# EAGLE schematic WatchDawg (EAGLE 9.4.2)
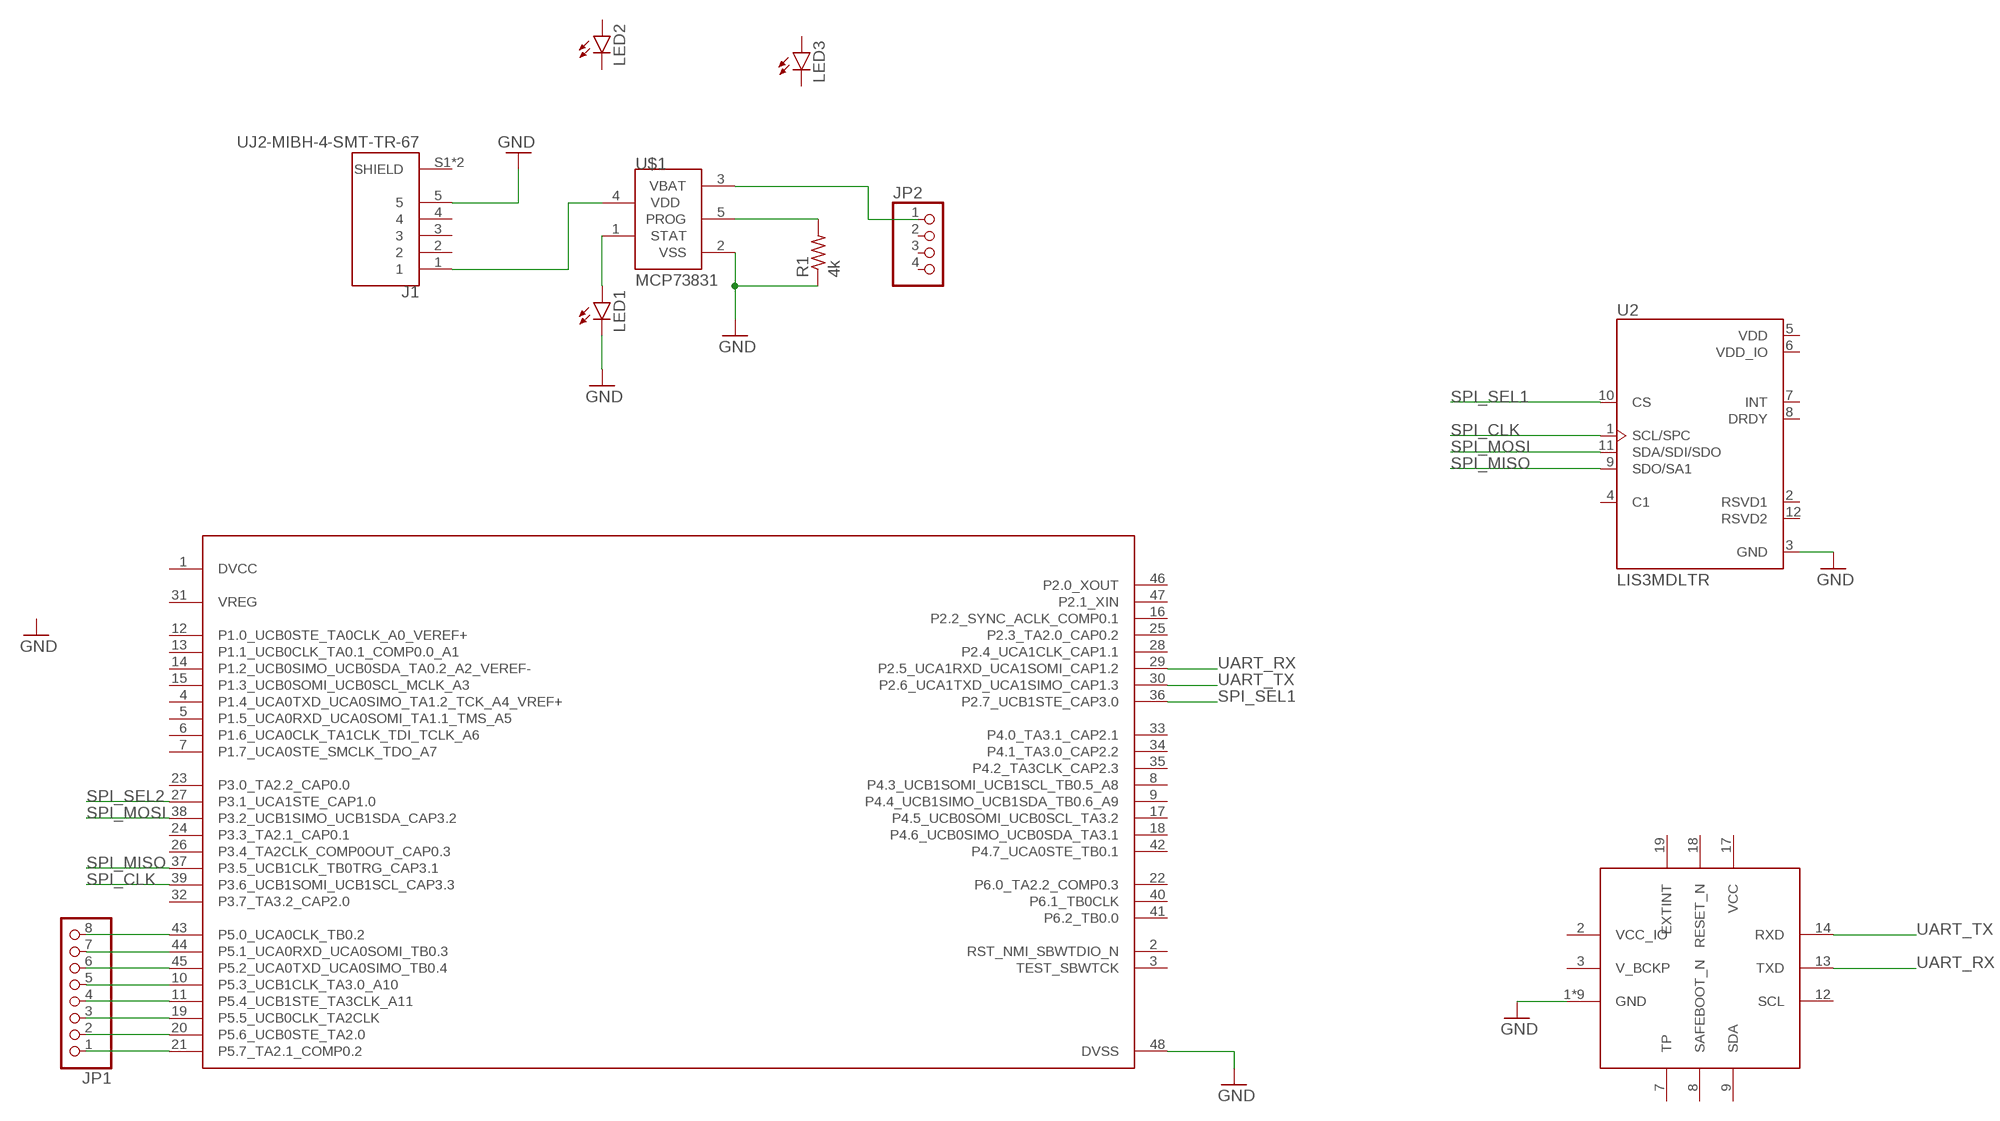
[diagram p0: schematic, sheet 1]

## Parts
IC1  SAM-M8Q  [SAM-M8Q]
J1  UJ2-MIBH-4-SMT-TR-67  [CUI_UJ2-MIBH-4-SMT-TR-67]
JP1  PINHD-1X8  [1X08]
JP2  PINHD-1X4  [1X04]
LED1  LEDCHIPLED_0603  [CHIPLED_0603]
LED2  LEDCHIPLED_0603  [CHIPLED_0603]
LED3  LEDCHIPLED_0603  [CHIPLED_0603]
MSP430  Value  MSP430FR2476TPTR  [PT0048A_N]
R1  4k  R-US_R0603  [R0603]
U2  LIS3MDLTR  [XDCR_LIS3MDLTR]
U$1  MCP73831  [SOT23-5L]

## Nets
GND: IC1.1(GND) IC1.4(GND) IC1.5(GND) IC1.6(GND) IC1.10(GND) IC1.11(GND) IC1.15(GND) IC1.16(GND) IC1.20(GND) J1.5 LED1.C MSP430.48(DVSS) R1.1 U2.3(GND) U$1.2(VSS)
N$1: JP1.8 MSP430.43(P5.0_UCA0CLK_TB0.2)
N$2: JP1.7 MSP430.44(P5.1_UCA0RXD_UCA0SOMI_TB0.3)
N$3: JP1.6 MSP430.45(P5.2_UCA0TXD_UCA0SIMO_TB0.4)
N$4: JP1.5 MSP430.10(P5.3_UCB1CLK_TA3.0_A10)
N$5: JP1.4 MSP430.11(P5.4_UCB1STE_TA3CLK_A11)
N$6: JP1.3 MSP430.19(P5.5_UCB0CLK_TA2CLK)
N$7: JP1.2 MSP430.20(P5.6_UCB0STE_TA2.0)
N$8: JP1.1 MSP430.21(P5.7_TA2.1_COMP0.2)
N$9: LED1.A U$1.1(STAT)
N$10: R1.2 U$1.5(PROG)
N$11: JP2.1 U$1.3(VBAT)
N$12: J1.1 U$1.4(VDD)
SPI_CLK: MSP430.39(P3.6_UCB1SOMI_UCB1SCL_CAP3.3) U2.1(SCL/SPC)
SPI_MISO: MSP430.37(P3.5_UCB1CLK_TB0TRG_CAP3.1) U2.9(SDO/SA1)
SPI_MOSI: MSP430.38(P3.2_UCB1SIMO_UCB1SDA_CAP3.2) U2.11(SDA/SDI/SDO)
SPI_SEL1: MSP430.36(P2.7_UCB1STE_CAP3.0) U2.10(CS)
SPI_SEL2: MSP430.27(P3.1_UCA1STE_CAP1.0)
UART_RX: IC1.13(TXD) MSP430.29(P2.5_UCA1RXD_UCA1SOMI_CAP1.2)
UART_TX: IC1.14(RXD) MSP430.30(P2.6_UCA1TXD_UCA1SIMO_CAP1.3)
Unconnected: IC1.2(VCC_IO) IC1.3(V_BCKP) IC1.7(TP) IC1.8(SAFEBOOT_N) IC1.9(SDA) IC1.12(SCL) IC1.17(VCC) IC1.18(RESET_N) IC1.19(EXTINT) J1.2 J1.3 J1.4 J1.S1(SHIELD) J1.S2(SHIELD) JP2.2 JP2.3 JP2.4 LED2.A LED2.C LED3.A LED3.C MSP430.2(RST_NMI_SBWTDIO_N) MSP430.3(TEST_SBWTCK) MSP430.4(P1.4_UCA0TXD_UCA0SIMO_TA1.2_TCK_A4_VREF+) MSP430.5(P1.5_UCA0RXD_UCA0SOMI_TA1.1_TMS_A5) MSP430.6(P1.6_UCA0CLK_TA1CLK_TDI_TCLK_A6) MSP430.7(P1.7_UCA0STE_SMCLK_TDO_A7) MSP430.8(P4.3_UCB1SOMI_UCB1SCL_TB0.5_A8) MSP430.9(P4.4_UCB1SIMO_UCB1SDA_TB0.6_A9) MSP430.12(P1.0_UCB0STE_TA0CLK_A0_VEREF+) MSP430.13(P1.1_UCB0CLK_TA0.1_COMP0.0_A1) MSP430.14(P1.2_UCB0SIMO_UCB0SDA_TA0.2_A2_VEREF-) MSP430.15(P1.3_UCB0SOMI_UCB0SCL_MCLK_A3) MSP430.16(P2.2_SYNC_ACLK_COMP0.1) MSP430.17(P4.5_UCB0SOMI_UCB0SCL_TA3.2) MSP430.18(P4.6_UCB0SIMO_UCB0SDA_TA3.1) MSP430.22(P6.0_TA2.2_COMP0.3) MSP430.23(P3.0_TA2.2_CAP0.0) MSP430.24(P3.3_TA2.1_CAP0.1) MSP430.25(P2.3_TA2.0_CAP0.2) MSP430.26(P3.4_TA2CLK_COMP0OUT_CAP0.3) MSP430.28(P2.4_UCA1CLK_CAP1.1) MSP430.32(P3.7_TA3.2_CAP2.0) MSP430.33(P4.0_TA3.1_CAP2.1) MSP430.34(P4.1_TA3.0_CAP2.2) MSP430.35(P4.2_TA3CLK_CAP2.3) MSP430.40(P6.1_TB0CLK) MSP430.41(P6.2_TB0.0) MSP430.42(P4.7_UCA0STE_TB0.1) MSP430.46(P2.0_XOUT) MSP430.47(P2.1_XIN) U2.2(RSVD1) U2.4(C1) U2.7(INT) U2.8(DRDY) U2.12(RSVD2)

## Power pins joined to a net without a drawn wire
DVCC: MSP430.1(DVCC)
VDD: U2.5(VDD)
VDD_IO: U2.6(VDD_IO)
VREG: MSP430.31(VREG)

## Library data of the parts
IC1 = ubloxLib:SAM-M8Q: u-blox SAM GNSS antenna module
J1 = WatchDawg - UJ2-MIBH-4-SMT-TR-67:UJ2-MIBH-4-SMT-TR-67: Micro B, USB 2.0, 1.8 A, Right Angle, Surface Mount (SMT), Waterproof, USB Receptacle; MANUFACTURER: CUI Inc; PARTREV: 1.0; STANDARD: Manufacturer Recommendations
JP1 = pinhead:PINHD-1X8: PIN HEADER
JP2 = pinhead:PINHD-1X4: PIN HEADER
LED1-LED3 = led:LED: LED OSRAM: - CHIPLED LG R971, LG N971, LY N971, LG Q971, LY Q971, LO R971, LY R971 LH N974, LH R974 LS Q976, LO Q976, LY Q976 LO Q996 - Hyper CHIPLED LW Q18S LB Q993, LB Q99A, LB R99A - SideLED LS A670, LO A670, LY A670, LG A670, LP A670 LB A673, LV A673, LT A673, LW A673 LH A674 LY A675 LS A676, LA A676, LO A676, LY A676, LW A676 LS A679, LY A679, LG A679 - Hyper Micro SIDELED® LS Y876, LA Y876, LO Y876, LY Y876 LT Y87S - SmartLED LW L88C, LW L88S LB L89C, LB L89S, LG L890 LS L89K, LO L89K, LY L89K LS L896, LA L896, LO L896, LY L896 - TOPLED LS T670, LO T670, LY T670, LG T670, LP T670 LSG T670, LSP T670, LSY T670, LOP T670, LYG T670 LG T671, LOG T671, LSG T671 LB T673, LV T673, LT T673, LW T673 LH T674 LS T676, LA T676, LO T676, LY T676, LB T676, LH T676, LSB T676, LW T676 LB T67C, LV T67C, LT T67C, LS T67K, LO T67K, LY T67K, LW E67C LS E67B, LA E67B, LO E67B, LY E67B, LB E67C, LV E67C, LT E67C LW T67C LS T679, LY T679, LG T679 LS T770, LO T770, LY T770, LG T770, LP T770 LB T773, LV T773, LT T773, LW T773 LH T774 LS E675, LA E675, LY E675, LS T675 LS T776, LA T776, LO T776, LY T776, LB T776 LHGB T686 LT T68C, LB T68C - Hyper Mini TOPLED® LB M676 - Mini TOPLED Santana® LG M470 LS M47K, LO M47K, LY M47K Source: http://www.osram.convergy.de LUXEON: - LUMILED® LXK2-PW12-R00, LXK2-PW12-S00, LXK2-PW14-U00, LXK2-PW14-V00 LXK2-PM12-R00, LXK2-PM12-S00, LXK2-PM14-U00 LXK2-PE12-Q00, LXK2-PE12-R00, LXK2-PE12-S00, LXK2-PE14-T00, LXK2-PE14-U00 LXK2-PB12-K00, LXK2-PB12-L00, LXK2-PB12-M00, LXK2-PB14-N00, LXK2-PB14-P00, LXK2-PB14-Q00 LXK2-PR12-L00, LXK2-PR12-M00, LXK2-PR14-Q00, LXK2-PR14-R00 LXK2-PD12-Q00, LXK2-PD12-R00, LXK2-PD12-S00 LXK2-PH12-R00, LXK2-PH12-S00 LXK2-PL12-P00, LXK2-PL12-Q00, LXK2-PL12-R00 Source: www.luxeon.com KINGBRIGHT: KA-3528ASYC Source: www.kingbright.com
MSP430 = MSP430:MSP430FR2476TPTR; MANUFACTURER: Texas Instruments; PARTNUMBER: MSP430FR2476TPTR; REFDES: RefDes; TYPE: TYPE
R1 = rcl:R-US_: RESISTOR, American symbol; SPICEPREFIX: R
U2 = LIS3MDLTR:LIS3MDLTR: LIS3MDL Series 3 Axis ±2/±8/±12/±16 g 3.6V High Performance Magnetometer LGA-12; DESCRIPTION: LIS3MDL Series 3 Axis ±2/±8/±12/±16 g 3.6V High Performance Magnetometer LGA-12; DIGI-KEY_PART_NUMBER: 497-13892-1-ND; DIGI-KEY_PURCHASE_URL: https://www.digikey.com/product-detail/en/stmicroelectronics/LIS3MDLTR/497-13892-1-ND/4309737?utm_source=snapeda&utm_medium=aggregator&utm_campaign=symbol; MF: STMicroelectronics; MP: LIS3MDLTR; PACKAGE: VFLGA-12 STMicroelectronics
U$1 = WatchDawg - mcp73831:MCP73831: Miniature Single-Cell, Fully Integrated Li-Ion, Li-Polymer Charge Management Controllers